# Altium schematic sheet RGBM-01.SchDoc
size Tabloid; SheetNumber: 1; SheetTotal: 7
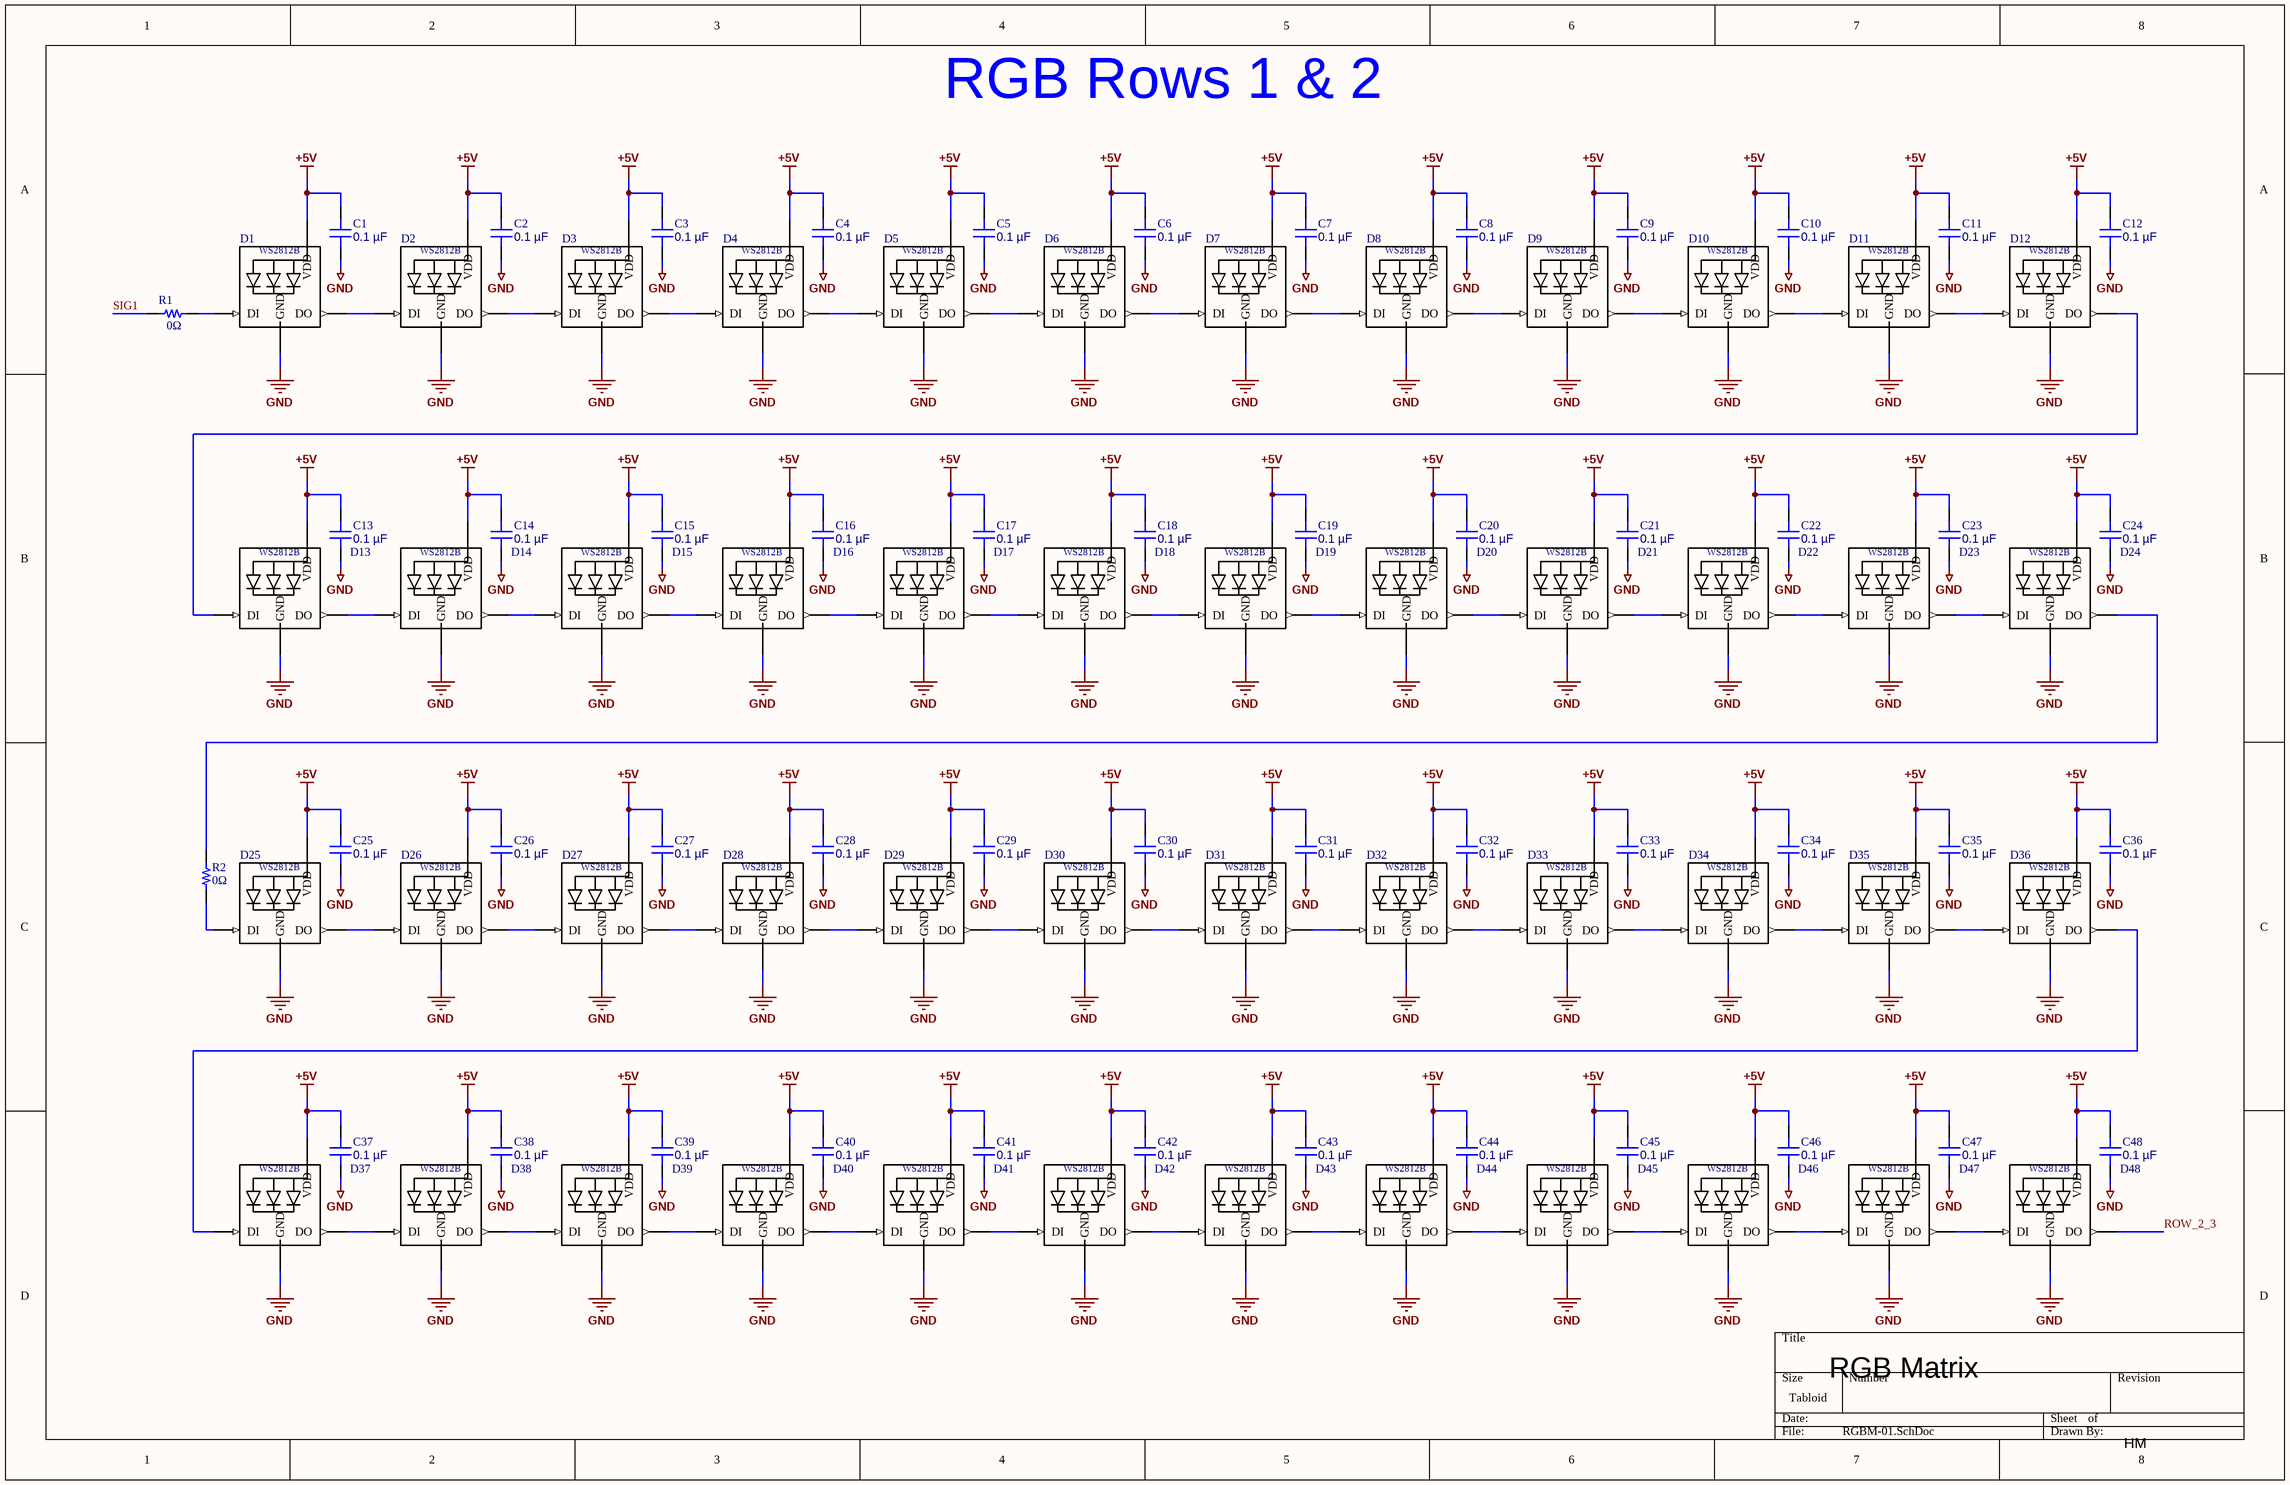
[diagram p0: RGBM-01.SchDoc]

## Parts
C1  0.1 µF  [CAP 0603_1608]
C2  0.1 µF  [CAP 0603_1608]
C3  0.1 µF  [CAP 0603_1608]
C4  0.1 µF  [CAP 0603_1608]
C5  0.1 µF  [CAP 0603_1608]
C6  0.1 µF  [CAP 0603_1608]
C7  0.1 µF  [CAP 0603_1608]
C8  0.1 µF  [CAP 0603_1608]
C9  0.1 µF  [CAP 0603_1608]
C10  0.1 µF  [CAP 0603_1608]
C11  0.1 µF  [CAP 0603_1608]
C12  0.1 µF  [CAP 0603_1608]
C13  0.1 µF  [CAP 0603_1608]
C14  0.1 µF  [CAP 0603_1608]
C15  0.1 µF  [CAP 0603_1608]
C16  0.1 µF  [CAP 0603_1608]
C17  0.1 µF  [CAP 0603_1608]
C18  0.1 µF  [CAP 0603_1608]
C19  0.1 µF  [CAP 0603_1608]
C20  0.1 µF  [CAP 0603_1608]
C21  0.1 µF  [CAP 0603_1608]
C22  0.1 µF  [CAP 0603_1608]
C23  0.1 µF  [CAP 0603_1608]
C24  0.1 µF  [CAP 0603_1608]
C25  0.1 µF  [CAP 0603_1608]
C26  0.1 µF  [CAP 0603_1608]
C27  0.1 µF  [CAP 0603_1608]
C28  0.1 µF  [CAP 0603_1608]
C29  0.1 µF  [CAP 0603_1608]
C30  0.1 µF  [CAP 0603_1608]
C31  0.1 µF  [CAP 0603_1608]
C32  0.1 µF  [CAP 0603_1608]
C33  0.1 µF  [CAP 0603_1608]
C34  0.1 µF  [CAP 0603_1608]
C35  0.1 µF  [CAP 0603_1608]
C36  0.1 µF  [CAP 0603_1608]
C37  0.1 µF  [CAP 0603_1608]
C38  0.1 µF  [CAP 0603_1608]
C39  0.1 µF  [CAP 0603_1608]
C40  0.1 µF  [CAP 0603_1608]
C41  0.1 µF  [CAP 0603_1608]
C42  0.1 µF  [CAP 0603_1608]
C43  0.1 µF  [CAP 0603_1608]
C44  0.1 µF  [CAP 0603_1608]
C45  0.1 µF  [CAP 0603_1608]
C46  0.1 µF  [CAP 0603_1608]
C47  0.1 µF  [CAP 0603_1608]
C48  0.1 µF  [CAP 0603_1608]
D1  WS2812B  [*WS2812B_WS2812B(Primary)]  (value not drawn)
D2  WS2812B  [*WS2812B_WS2812B(Primary)]  (value not drawn)
D3  WS2812B  [*WS2812B_WS2812B(Primary)]  (value not drawn)
D4  WS2812B  [*WS2812B_WS2812B(Primary)]  (value not drawn)
D5  WS2812B  [*WS2812B_WS2812B(Primary)]  (value not drawn)
D6  WS2812B  [*WS2812B_WS2812B(Primary)]  (value not drawn)
D7  WS2812B  [*WS2812B_WS2812B(Primary)]  (value not drawn)
D8  WS2812B  [*WS2812B_WS2812B(Primary)]  (value not drawn)
D9  WS2812B  [*WS2812B_WS2812B(Primary)]  (value not drawn)
D10  WS2812B  [*WS2812B_WS2812B(Primary)]  (value not drawn)
D11  WS2812B  [*WS2812B_WS2812B(Primary)]  (value not drawn)
D12  WS2812B  [*WS2812B_WS2812B(Primary)]  (value not drawn)
D13  WS2812B  [*WS2812B_WS2812B(Primary)]  (value not drawn)
D14  WS2812B  [*WS2812B_WS2812B(Primary)]  (value not drawn)
D15  WS2812B  [*WS2812B_WS2812B(Primary)]  (value not drawn)
D16  WS2812B  [*WS2812B_WS2812B(Primary)]  (value not drawn)
D17  WS2812B  [*WS2812B_WS2812B(Primary)]  (value not drawn)
D18  WS2812B  [*WS2812B_WS2812B(Primary)]  (value not drawn)
D19  WS2812B  [*WS2812B_WS2812B(Primary)]  (value not drawn)
D20  WS2812B  [*WS2812B_WS2812B(Primary)]  (value not drawn)
D21  WS2812B  [*WS2812B_WS2812B(Primary)]  (value not drawn)
D22  WS2812B  [*WS2812B_WS2812B(Primary)]  (value not drawn)
D23  WS2812B  [*WS2812B_WS2812B(Primary)]  (value not drawn)
D24  WS2812B  [*WS2812B_WS2812B(Primary)]  (value not drawn)
D25  WS2812B  [*WS2812B_WS2812B(Primary)]  (value not drawn)
D26  WS2812B  [*WS2812B_WS2812B(Primary)]  (value not drawn)
D27  WS2812B  [*WS2812B_WS2812B(Primary)]  (value not drawn)
D28  WS2812B  [*WS2812B_WS2812B(Primary)]  (value not drawn)
D29  WS2812B  [*WS2812B_WS2812B(Primary)]  (value not drawn)
D30  WS2812B  [*WS2812B_WS2812B(Primary)]  (value not drawn)
D31  WS2812B  [*WS2812B_WS2812B(Primary)]  (value not drawn)
D32  WS2812B  [*WS2812B_WS2812B(Primary)]  (value not drawn)
D33  WS2812B  [*WS2812B_WS2812B(Primary)]  (value not drawn)
D34  WS2812B  [*WS2812B_WS2812B(Primary)]  (value not drawn)
D35  WS2812B  [*WS2812B_WS2812B(Primary)]  (value not drawn)
D36  WS2812B  [*WS2812B_WS2812B(Primary)]  (value not drawn)
D37  WS2812B  [*WS2812B_WS2812B(Primary)]  (value not drawn)
D38  WS2812B  [*WS2812B_WS2812B(Primary)]  (value not drawn)
D39  WS2812B  [*WS2812B_WS2812B(Primary)]  (value not drawn)
D40  WS2812B  [*WS2812B_WS2812B(Primary)]  (value not drawn)
D41  WS2812B  [*WS2812B_WS2812B(Primary)]  (value not drawn)
D42  WS2812B  [*WS2812B_WS2812B(Primary)]  (value not drawn)
D43  WS2812B  [*WS2812B_WS2812B(Primary)]  (value not drawn)
D44  WS2812B  [*WS2812B_WS2812B(Primary)]  (value not drawn)
D45  WS2812B  [*WS2812B_WS2812B(Primary)]  (value not drawn)
D46  WS2812B  [*WS2812B_WS2812B(Primary)]  (value not drawn)
D47  WS2812B  [*WS2812B_WS2812B(Primary)]  (value not drawn)
D48  WS2812B  [*WS2812B_WS2812B(Primary)]  (value not drawn)
R1  0Ω  [RES 0603_1608]
R2  0Ω  [RES 0603_1608]

## Nets
+5V: C1.2 C2.2 C3.2 C4.2 C5.2 C6.2 C7.2 C8.2 C9.2 C10.2 C11.2 C12.2 C13.2 C14.2 C15.2 C16.2 C17.2 C18.2 C19.2 C20.2 C21.2 C22.2 C23.2 C24.2 C25.2 C26.2 C27.2 C28.2 C29.2 C30.2 C31.2 C32.2 C33.2 C34.2 C35.2 C36.2 C37.2 C38.2 C39.2 C40.2 C41.2 C42.2 C43.2 C44.2 C45.2 C46.2 C47.2 C48.2 D1.1-VDD(VDD) D2.1-VDD(VDD) D3.1-VDD(VDD) D4.1-VDD(VDD) D5.1-VDD(VDD) D6.1-VDD(VDD) D7.1-VDD(VDD) D8.1-VDD(VDD) D9.1-VDD(VDD) D10.1-VDD(VDD) D11.1-VDD(VDD) D12.1-VDD(VDD) D13.1-VDD(VDD) D14.1-VDD(VDD) D15.1-VDD(VDD) D16.1-VDD(VDD) D17.1-VDD(VDD) D18.1-VDD(VDD) D19.1-VDD(VDD) D20.1-VDD(VDD) D21.1-VDD(VDD) D22.1-VDD(VDD) D23.1-VDD(VDD) D24.1-VDD(VDD) D25.1-VDD(VDD) D26.1-VDD(VDD) D27.1-VDD(VDD) D28.1-VDD(VDD) D29.1-VDD(VDD) D30.1-VDD(VDD) D31.1-VDD(VDD) D32.1-VDD(VDD) D33.1-VDD(VDD) D34.1-VDD(VDD) D35.1-VDD(VDD) D36.1-VDD(VDD) D37.1-VDD(VDD) D38.1-VDD(VDD) D39.1-VDD(VDD) D40.1-VDD(VDD) D41.1-VDD(VDD) D42.1-VDD(VDD) D43.1-VDD(VDD) D44.1-VDD(VDD) D45.1-VDD(VDD) D46.1-VDD(VDD) D47.1-VDD(VDD) D48.1-VDD(VDD)
GND: C1.1 C2.1 C3.1 C4.1 C5.1 C6.1 C7.1 C8.1 C9.1 C10.1 C11.1 C12.1 C13.1 C14.1 C15.1 C16.1 C17.1 C18.1 C19.1 C20.1 C21.1 C22.1 C23.1 C24.1 C25.1 C26.1 C27.1 C28.1 C29.1 C30.1 C31.1 C32.1 C33.1 C34.1 C35.1 C36.1 C37.1 C38.1 C39.1 C40.1 C41.1 C42.1 C43.1 C44.1 C45.1 C46.1 C47.1 C48.1 D1.3-GND(GND) D2.3-GND(GND) D3.3-GND(GND) D4.3-GND(GND) D5.3-GND(GND) D6.3-GND(GND) D7.3-GND(GND) D8.3-GND(GND) D9.3-GND(GND) D10.3-GND(GND) D11.3-GND(GND) D12.3-GND(GND) D13.3-GND(GND) D14.3-GND(GND) D15.3-GND(GND) D16.3-GND(GND) D17.3-GND(GND) D18.3-GND(GND) D19.3-GND(GND) D20.3-GND(GND) D21.3-GND(GND) D22.3-GND(GND) D23.3-GND(GND) D24.3-GND(GND) D25.3-GND(GND) D26.3-GND(GND) D27.3-GND(GND) D28.3-GND(GND) D29.3-GND(GND) D30.3-GND(GND) D31.3-GND(GND) D32.3-GND(GND) D33.3-GND(GND) D34.3-GND(GND) D35.3-GND(GND) D36.3-GND(GND) D37.3-GND(GND) D38.3-GND(GND) D39.3-GND(GND) D40.3-GND(GND) D41.3-GND(GND) D42.3-GND(GND) D43.3-GND(GND) D44.3-GND(GND) D45.3-GND(GND) D46.3-GND(GND) D47.3-GND(GND) D48.3-GND(GND)
ROW_2_3: D48.2-DOUT(DO)
SIG1: R1.1
NetD1_2-DOUT: D1.2-DOUT(DO) D2.4-DIN(DI)
NetD1_4-DIN: D1.4-DIN(DI) R1.2
NetD2_2-DOUT: D2.2-DOUT(DO) D3.4-DIN(DI)
NetD3_2-DOUT: D3.2-DOUT(DO) D4.4-DIN(DI)
NetD4_2-DOUT: D4.2-DOUT(DO) D5.4-DIN(DI)
NetD5_2-DOUT: D5.2-DOUT(DO) D6.4-DIN(DI)
NetD6_2-DOUT: D6.2-DOUT(DO) D7.4-DIN(DI)
NetD7_2-DOUT: D7.2-DOUT(DO) D8.4-DIN(DI)
NetD8_2-DOUT: D8.2-DOUT(DO) D9.4-DIN(DI)
NetD9_2-DOUT: D9.2-DOUT(DO) D10.4-DIN(DI)
NetD10_2-DOUT: D10.2-DOUT(DO) D11.4-DIN(DI)
NetD11_2-DOUT: D11.2-DOUT(DO) D12.4-DIN(DI)
NetD12_2-DOUT: D12.2-DOUT(DO) D13.4-DIN(DI)
NetD13_2-DOUT: D13.2-DOUT(DO) D14.4-DIN(DI)
NetD14_2-DOUT: D14.2-DOUT(DO) D15.4-DIN(DI)
NetD15_2-DOUT: D15.2-DOUT(DO) D16.4-DIN(DI)
NetD16_2-DOUT: D16.2-DOUT(DO) D17.4-DIN(DI)
NetD17_2-DOUT: D17.2-DOUT(DO) D18.4-DIN(DI)
NetD18_2-DOUT: D18.2-DOUT(DO) D19.4-DIN(DI)
NetD19_2-DOUT: D19.2-DOUT(DO) D20.4-DIN(DI)
NetD20_2-DOUT: D20.2-DOUT(DO) D21.4-DIN(DI)
NetD21_2-DOUT: D21.2-DOUT(DO) D22.4-DIN(DI)
NetD22_2-DOUT: D22.2-DOUT(DO) D23.4-DIN(DI)
NetD23_2-DOUT: D23.2-DOUT(DO) D24.4-DIN(DI)
NetD24_2-DOUT: D24.2-DOUT(DO) R2.2
NetD25_2-DOUT: D25.2-DOUT(DO) D26.4-DIN(DI)
NetD25_4-DIN: D25.4-DIN(DI) R2.1
NetD26_2-DOUT: D26.2-DOUT(DO) D27.4-DIN(DI)
NetD27_2-DOUT: D27.2-DOUT(DO) D28.4-DIN(DI)
NetD28_2-DOUT: D28.2-DOUT(DO) D29.4-DIN(DI)
NetD29_2-DOUT: D29.2-DOUT(DO) D30.4-DIN(DI)
NetD30_2-DOUT: D30.2-DOUT(DO) D31.4-DIN(DI)
NetD31_2-DOUT: D31.2-DOUT(DO) D32.4-DIN(DI)
NetD32_2-DOUT: D32.2-DOUT(DO) D33.4-DIN(DI)
NetD33_2-DOUT: D33.2-DOUT(DO) D34.4-DIN(DI)
NetD34_2-DOUT: D34.2-DOUT(DO) D35.4-DIN(DI)
NetD35_2-DOUT: D35.2-DOUT(DO) D36.4-DIN(DI)
NetD36_2-DOUT: D36.2-DOUT(DO) D37.4-DIN(DI)
NetD37_2-DOUT: D37.2-DOUT(DO) D38.4-DIN(DI)
NetD38_2-DOUT: D38.2-DOUT(DO) D39.4-DIN(DI)
NetD39_2-DOUT: D39.2-DOUT(DO) D40.4-DIN(DI)
NetD40_2-DOUT: D40.2-DOUT(DO) D41.4-DIN(DI)
NetD41_2-DOUT: D41.2-DOUT(DO) D42.4-DIN(DI)
NetD42_2-DOUT: D42.2-DOUT(DO) D43.4-DIN(DI)
NetD43_2-DOUT: D43.2-DOUT(DO) D44.4-DIN(DI)
NetD44_2-DOUT: D44.2-DOUT(DO) D45.4-DIN(DI)
NetD45_2-DOUT: D45.2-DOUT(DO) D46.4-DIN(DI)
NetD46_2-DOUT: D46.2-DOUT(DO) D47.4-DIN(DI)
NetD47_2-DOUT: D47.2-DOUT(DO) D48.4-DIN(DI)

## Notes on the sheet
- RGB Rows 1 & 2
- RGB Matrix
- HM

## Library data of the parts
C1-C48 = C0603C104K5RAC7411: CAP CER 0.1UF 50V X7R 0603; manufacturer: KEMET; Tolerance: ±10%; Part Number: C0603C104K5RAC7411; Capacitance: 0.1 µF; Applications: Bypass, Decoupling; componentlink1description: Datasheet; componentlink1url: https://api.kemet.com/component-edge/download/datasheet/C0603C104K5RAC7411.pdf; componentlink2description: DigiKey Link; componentlink2url: https://www.digikey.com/en/products/detail/kemet/C0603C104K5RAC7411/3317013; Device Package: 0603 (1608 Metric); lastupdated: 2026-04-06 7:23:52 PM; Lifecycle Status: Active; Minimum Order: 1; Mounting Type: Surface Mount, MLCC; Operating Temperature: -55°C ~ 125°C; Package / Case: 0603 (1608 Metric); packaging: TapeAndReel; partid: 2233; Part Status: Active; price: 0.01; series: SMD Comm X7R; Size / Dimension: 0.063" L x 0.031" W (1.60mm x 0.80mm); Supplier 1: DigiKey; Supplier Part Number 1: 399-C0603C104K5RAC7411CT-ND; Temperature Coefficient: X7R; Thickness (Max): 0.035" (0.90mm); value: 0.1 µF; Voltage - Rated: 50V
D1-D48 = WS2812B: Intelligent control LED integrated light source; MF: Worldsemi; SnapEDA_Link: https://www.snapeda.com/parts/WS2812B/Worldsemi/view-part/?ref=snap; Package: None; MP: WS2812B; Check_prices: https://www.snapeda.com/parts/WS2812B/Worldsemi/view-part/?ref=eda; Value: *
R1 R2 = YJP1608-R001: RES SMD 0 OHM JUMPER 0603; Manufacturer: Susumu; Value: 0 Ohms; Part Number: YJP1608-R001; ComponentLink1Description: Datasheet; ComponentLink1URL: http://www.susumu.co.jp/common/pdf/n_catalog_partition10_en.pdf; ComponentLink2Description: DigiKey Link; ComponentLink2URL: https://www.digikey.com/en/products/detail/susumu/YJP1608-R001/2815047; Composition: Thin Film; Device Package: 0603 (1608 Metric); Height - Seated (Max): 0.016" (0.40mm); LastUpdated: 2024-02-09 8:42:50 PM; Lifecycle Status: Active; Minimum Order: 1; Number of Terminations: 2; Operating Temperature: -40°C ~ 125°C; Package / Case: 0603 (1608 Metric); Packaging: TapeAndReel; PartId: 16802; Part Status: Active; Price: 0.08; Resistance: 0 Ohms; Series: YJP; Size / Dimension: 0.063" L x 0.031" W (1.60mm x 0.80mm); Supplier 1: DigiKey; Supplier Part Number 1: 408-1515-1-ND; Supplier Device Package: 0603; Tolerance: Jumper